# EAGLE design a130-8-octal-vca-expander (EAGLE 7.7.0)

## Sheet 1 of 5
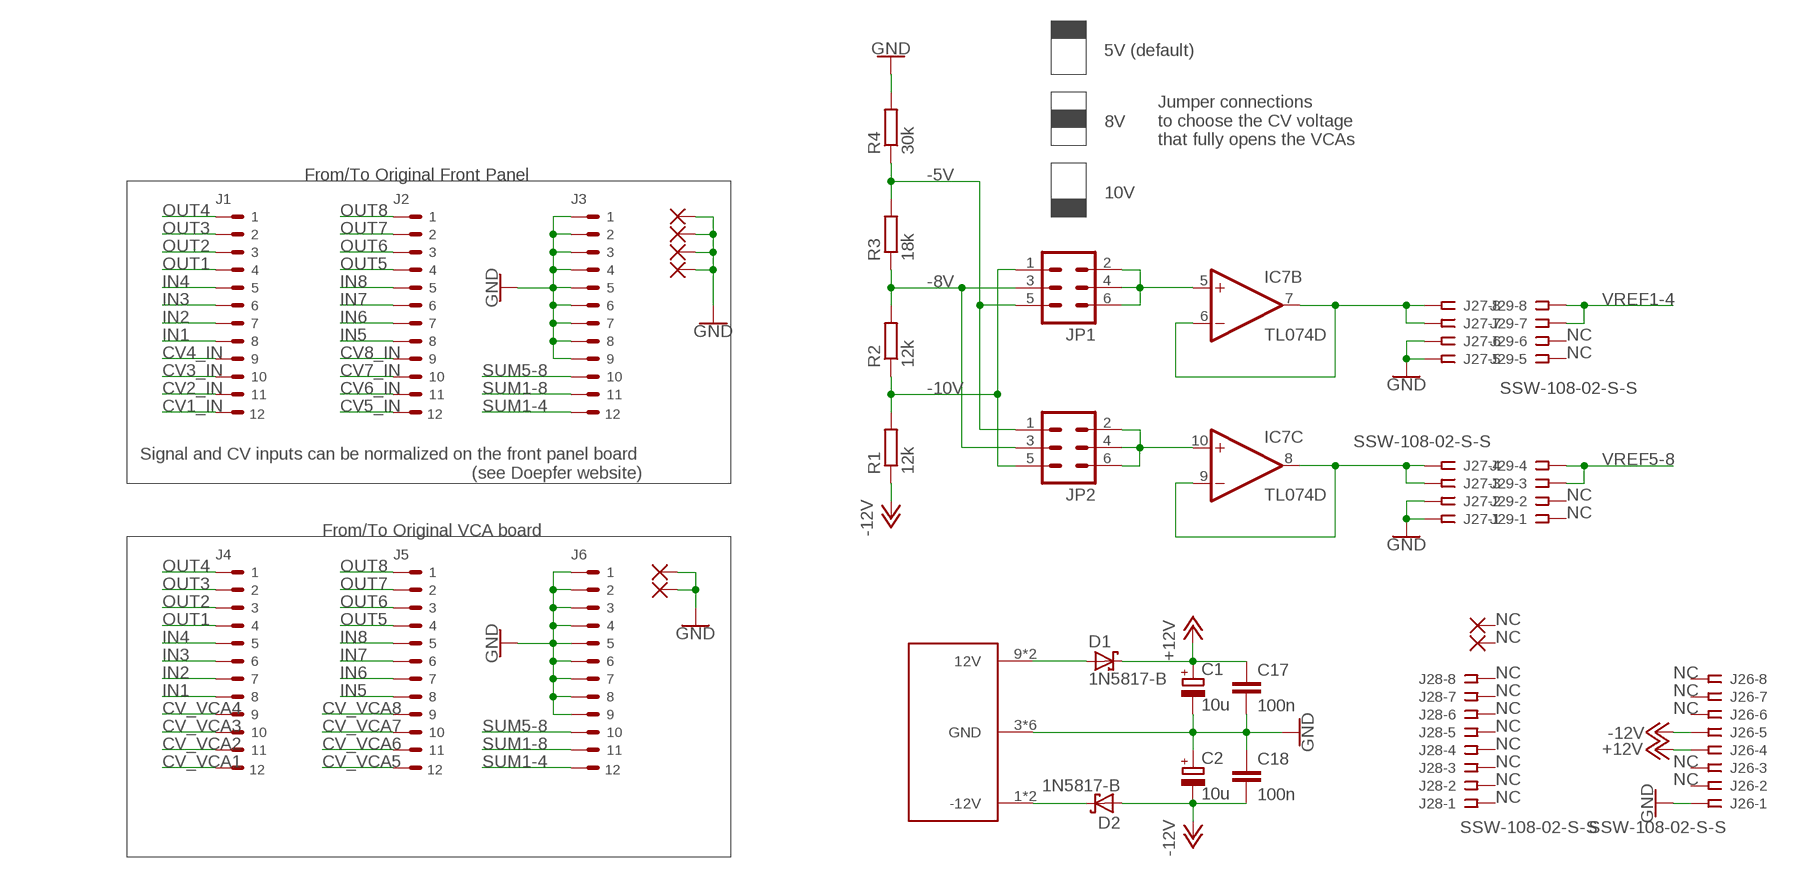
[diagram p0: schematic, sheet 1]

### Parts
C1  10u  CPOL-EUE2-5  [E2-5]
C2  10u  CPOL-EUE2-5  [E2-5]
C17  100n  C-EUC0603  [C0603]
C18  100n  C-EUC0603  [C0603]
D1  1N5817-B  [DO41-7.6]
D2  1N5817-B  [DO41-7.6]
IC7  TL074D  [SO14]
J1  PIN_HEADER_1X12_2MM_GRID  [PIN_HEADER_1X12_2MM_GRID]
J2  PIN_HEADER_1X12_2MM_GRID  [PIN_HEADER_1X12_2MM_GRID]
J3  PIN_HEADER_1X12_2MM_GRID  [PIN_HEADER_1X12_2MM_GRID]
J4  PIN_HEADER_1X12_2MM_GRID  [PIN_HEADER_1X12_2MM_GRID]
J5  PIN_HEADER_1X12_2MM_GRID  [PIN_HEADER_1X12_2MM_GRID]
J6  PIN_HEADER_1X12_2MM_GRID  [PIN_HEADER_1X12_2MM_GRID]
J25  A100-BUS_HEADER_10P  [DOEPFER_2X05]
J26  SSW-108-02-S-S  [SSW-108-02-S-S]
J27  SSW-108-02-S-S  [SSW-108-02-S-S]
J28  SSW-108-02-S-S  [SSW-108-02-S-S]
J29  SSW-108-02-S-S  [SSW-108-02-S-S]
JP1  MA03-2  [MA03-2]
JP2  MA03-2  [MA03-2]
PAD1  2,15/1,0  [2,15/1,0]
PAD2  2,15/1,0  [2,15/1,0]
PAD3  2,15/1,0  [2,15/1,0]
PAD4  2,15/1,0  [2,15/1,0]
PAD5  2,15/1,0  [2,15/1,0]
PAD6  2,15/1,0  [2,15/1,0]
PAD7  2,15/1,0  [2,15/1,0]
PAD9  2,15/1,0  [2,15/1,0]
R1  12k  R-EU_M0805  [M0805]
R2  12k  R-EU_M0805  [M0805]
R3  18k  R-EU_M0805  [M0805]
R4  30k  R-EU_M0805  [M0805]

### Nets
+12V: C1.+ C17.1 D1.C J26.4 ; also sheet 2,3,4,5
-5V: JP1.5 JP2.1 R3.2 R4.1
-8V: JP1.3 JP2.3 R2.2 R3.1
-10V: JP1.1 JP2.5 R1.2 R2.1
-12V: C2.- C18.2 D2.A J26.5 R1.1 ; also sheet 2,3,4,5
CV1_IN: J1.12(S11) ; also sheet 2
CV2_IN: J1.11(S10) ; also sheet 2
CV3_IN: J1.10(S9) ; also sheet 3
CV4_IN: J1.9(S8) ; also sheet 3
CV5_IN: J2.12(S11) ; also sheet 4
CV6_IN: J2.11(S10) ; also sheet 4
CV7_IN: J2.10(S9) ; also sheet 5
CV8_IN: J2.9(S8) ; also sheet 5
CV_VCA1: J4.12(S11) ; also sheet 2
CV_VCA2: J4.11(S10) ; also sheet 2
CV_VCA3: J4.10(S9) ; also sheet 3
CV_VCA4: J4.9(S8) ; also sheet 3
CV_VCA5: J5.12(S11) ; also sheet 4
CV_VCA6: J5.11(S10) ; also sheet 4
CV_VCA7: J5.10(S9) ; also sheet 5
CV_VCA8: J5.9(S8) ; also sheet 5
GND: C1.- C2.+ C17.2 C18.1 J3.1(S1) J3.2(S2) J3.3(S3) J3.4(S4) J3.5(S) J3.6(S5) J3.7(S6) J3.8(S7) J3.9(S8) J6.1(S1) J6.2(S2) J6.3(S3) J6.4(S4) J6.5(S) J6.6(S5) J6.7(S6) J6.8(S7) J6.9(S8) J25.3(GND) J25.4(GND) J25.5(GND) J25.6(GND) J25.7(GND) J25.8(GND) J26.1 J27.1 J27.2 J27.5 J27.6 PAD1.1(P) PAD2.1(P) PAD3.1(P) PAD4.1(P) PAD5.1(P) PAD6.1(P) R4.2 ; also sheet 2,3,4,5
IN1: J1.8(S7) J4.8(S7)
IN2: J1.7(S6) J4.7(S6)
IN3: J1.6(S5) J4.6(S5)
IN4: J1.4(S4) J4.4(S4)
IN5: J2.8(S7) J5.8(S7)
IN6: J2.7(S6) J5.7(S6)
IN7: J2.6(S5) J5.6(S5)
IN8: J2.4(S4) J5.4(S4)
N$4: D1.A J25.9(12V) J25.10(12V)
N$5: D2.C J25.1(-12V) J25.2(-12V)
N$27: IC7.5(B:+IN) JP1.2 JP1.4 JP1.6
N$57: IC7.6(B:-IN) IC7.7(B:OUT) J27.7 J27.8
N$73: IC7.10(C:+IN) JP2.2 JP2.4 JP2.6
N$87: IC7.8(C:OUT) IC7.9(C:-IN) J27.3 J27.4
OUT1: J1.3(S3) J4.3(S3)
OUT2: J1.2(S2) J4.2(S2)
OUT3: J1.1(S1) J4.1(S1)
OUT4: J1.5(S) J4.5(S)
OUT5: J2.3(S3) J5.3(S3)
OUT6: J2.2(S2) J5.2(S2)
OUT7: J2.1(S1) J5.1(S1)
OUT8: J2.5(S) J5.5(S)
SUM1-4: J3.12(S11) J6.12(S11)
SUM1-8: J3.11(S10) J6.11(S10)
SUM5-8: J3.10(S9) J6.10(S9)
VREF1-4: J29.7 J29.8 ; also sheet 2,3
VREF5-8: J29.3 J29.4 ; also sheet 4,5
Unconnected: J26.2 J26.3 J26.6 J26.7 J26.8 J28.1 J28.2 J28.3 J28.4 J28.5 J28.6 J28.7 J28.8 J29.1 J29.2 J29.5 J29.6 PAD7.1(P) PAD9.1(P)

### Notes on the sheet
- 5V (default)
- 8V
- Jumper connections
  to choose the CV voltage 
  that fully opens the VCAs
- From/To Original Front Panel
- 10V
- NC
- NC
- Signal and CV inputs can be normalized on the front panel board 
  (see Doepfer website)
- NC
- NC
- From/To Original VCA board
- NC
- NC
- NC | NC
- NC | NC
- NC | NC
- NC
- NC
- NC | NC
- NC | NC
- NC

## Sheet 2 of 5
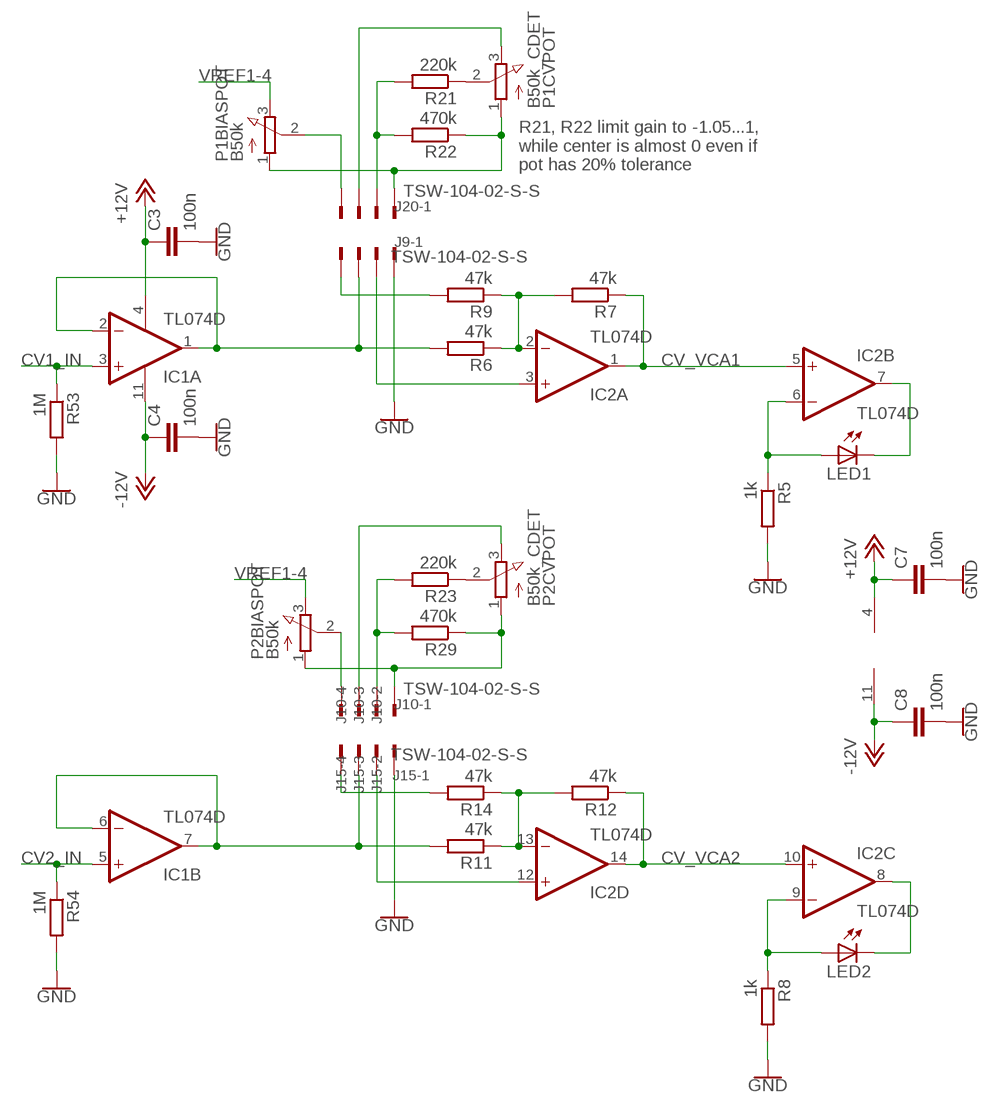
[diagram p1: schematic, sheet 2]

### Parts
C3  100n  C-EUC0603  [C0603]
C4  100n  C-EUC0603  [C0603]
C7  100n  C-EUC0603  [C0603]
C8  100n  C-EUC0603  [C0603]
IC1  TL074D  [SO14]
IC2  TL074D  [SO14]
IC3  TL074D  [SO14]
J9  TSW-104-02-S-S  [TSW-104-02-S-S]
J10  TSW-104-02-S-S  [TSW-104-02-S-S]
J15  TSW-104-02-S-S  [TSW-104-02-S-S]
J20  TSW-104-02-S-S  [TSW-104-02-S-S]
LED1  LED3MM  [LED3MM]
LED2  LED3MM  [LED3MM]
P1BIAS  B50k  P0915N_NARROW  [EVUF]
P1CV  B50k_CDET  P0915N_NARROW  [EVUF]
P2BIAS  B50k  P0915N_NARROW  [EVUF]
P2CV  B50k_CDET  P0915N_NARROW  [EVUF]
R5  1k  R-EU_M0805  [M0805]
R6  47k  R-EU_M0805  [M0805]
R7  47k  R-EU_M0805  [M0805]
R8  1k  R-EU_M0805  [M0805]
R9  47k  R-EU_M0805  [M0805]
R11  47k  R-EU_M0805  [M0805]
R12  47k  R-EU_M0805  [M0805]
R14  47k  R-EU_M0805  [M0805]
R21  220k  R-EU_M0805  [M0805]
R22  470k  R-EU_M0805  [M0805]
R23  220k  R-EU_M0805  [M0805]
R29  470k  R-EU_M0805  [M0805]
R53  1M  R-EU_M0805  [M0805]
R54  1M  R-EU_M0805  [M0805]

### Nets
+12V: C3.1 C7.1 IC1.4(P:V+) IC3.4(P:V+) ; also sheet 1,3,4,5
-12V: C4.1 C8.1 IC1.11(P:V-) IC3.11(P:V-) ; also sheet 1,3,4,5
CV1_IN: IC1.3(A:+IN) R53.1 ; also sheet 1
CV2_IN: IC1.5(B:+IN) R54.1 ; also sheet 1
CV_VCA1: IC2.1(A:OUT) IC2.5(B:+IN) R7.1 ; also sheet 1
CV_VCA2: IC2.10(C:+IN) IC2.14(D:OUT) R12.1 ; also sheet 1
GND: C3.2 C4.2 C7.2 C8.2 J15.1 J20.1 R5.2 R8.2 R53.2 R54.2 ; also sheet 1,3,4,5
N$1: J9.4 P1BIAS.2
N$2: IC1.1(A:OUT) IC1.2(A:-IN) J20.3 R6.2
N$3: IC2.2(A:-IN) R6.1 R7.2 R9.1
N$8: J20.4 R9.2
N$9: IC1.6(B:-IN) IC1.7(B:OUT) J15.3 R11.2
N$10: IC2.12(D:+IN) J15.2
N$11: IC2.13(D:-IN) R11.1 R12.2 R14.1
N$12: J9.1 P1BIAS.1 P1CV.1 R22.1
N$19: IC2.6(B:-IN) LED1.A R5.1
N$20: IC2.7(B:OUT) LED1.K(C)
N$21: IC2.8(C:OUT) LED2.K(C)
N$22: IC2.9(C:-IN) LED2.A R8.1
N$53: J15.4 R14.2
N$54: P2CV.2 R23.1
N$58: J9.3 P1CV.3
N$59: IC2.3(A:+IN) J20.2
N$60: J10.1 P2BIAS.1 P2CV.1 R29.1
N$61: J10.2 R23.2 R29.2
N$62: J10.3 P2CV.3
N$63: J10.4 P2BIAS.2
N$86: P1CV.2 R21.1
N$88: J9.2 R21.2 R22.2
VREF1-4: P1BIAS.3 P2BIAS.3 ; also sheet 1,3
Unconnected: P1BIAS.M1(C$1) P1BIAS.M2(C$2) P1CV.M1(C$1) P1CV.M2(C$2) P2BIAS.M1(C$1) P2BIAS.M2(C$2) P2CV.M1(C$1) P2CV.M2(C$2)

### Notes on the sheet
- R21, R22 limit gain to -1.05...1,
  while center is almost 0 even if
  pot has 20% tolerance

## Sheet 3 of 5
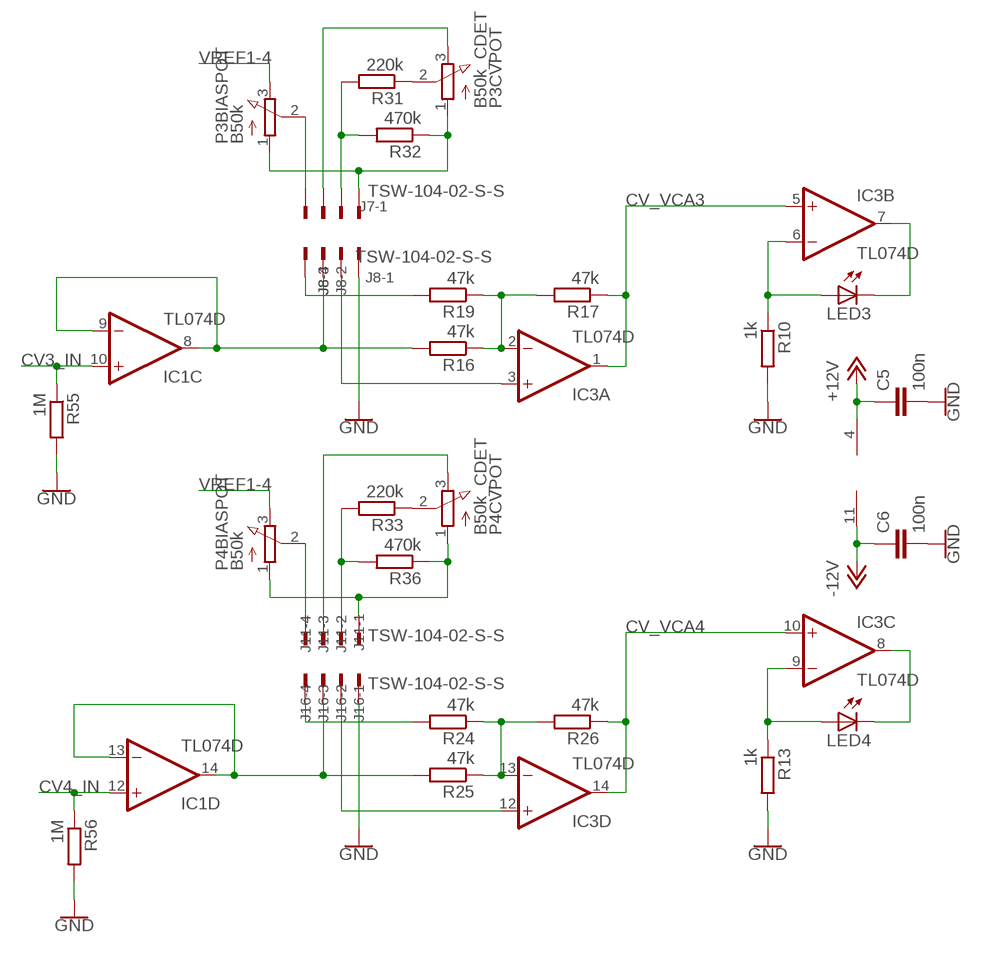
[diagram p2: schematic, sheet 3]

### Parts
C5  100n  C-EUC0603  [C0603]
C6  100n  C-EUC0603  [C0603]
J7  TSW-104-02-S-S  [TSW-104-02-S-S]
J8  TSW-104-02-S-S  [TSW-104-02-S-S]
J11  TSW-104-02-S-S  [TSW-104-02-S-S]
J16  TSW-104-02-S-S  [TSW-104-02-S-S]
LED3  LED3MM  [LED3MM]
LED4  LED3MM  [LED3MM]
P3BIAS  B50k  P0915N_NARROW  [EVUF]
P3CV  B50k_CDET  P0915N_NARROW  [EVUF]
P4BIAS  B50k  P0915N_NARROW  [EVUF]
P4CV  B50k_CDET  P0915N_NARROW  [EVUF]
R10  1k  R-EU_M0805  [M0805]
R13  1k  R-EU_M0805  [M0805]
R16  47k  R-EU_M0805  [M0805]
R17  47k  R-EU_M0805  [M0805]
R19  47k  R-EU_M0805  [M0805]
R24  47k  R-EU_M0805  [M0805]
R25  47k  R-EU_M0805  [M0805]
R26  47k  R-EU_M0805  [M0805]
R31  220k  R-EU_M0805  [M0805]
R32  470k  R-EU_M0805  [M0805]
R33  220k  R-EU_M0805  [M0805]
R36  470k  R-EU_M0805  [M0805]
R55  1M  R-EU_M0805  [M0805]
R56  1M  R-EU_M0805  [M0805]

### Nets
+12V: C5.1 IC2.4(P:V+) ; also sheet 1,2,4,5
-12V: C6.1 IC2.11(P:V-) ; also sheet 1,2,4,5
CV3_IN: IC1.10(C:+IN) R55.1 ; also sheet 1
CV4_IN: IC1.12(D:+IN) R56.1 ; also sheet 1
CV_VCA3: IC3.1(A:OUT) IC3.5(B:+IN) R17.1 ; also sheet 1
CV_VCA4: IC3.10(C:+IN) IC3.14(D:OUT) R26.1 ; also sheet 1
GND: C5.2 C6.2 J8.1 J16.1 R10.2 R13.2 R55.2 R56.2 ; also sheet 1,2,4,5
N$6: IC1.8(C:OUT) IC1.9(C:-IN) J8.3 R16.2
N$7: J7.4 P3BIAS.2
N$13: IC3.2(A:-IN) R16.1 R17.2 R19.1
N$14: J8.4 R19.2
N$15: IC1.13(D:-IN) IC1.14(D:OUT) J16.3 R25.2
N$16: J16.4 R24.2
N$17: IC3.13(D:-IN) R24.1 R25.1 R26.2
N$18: IC3.12(D:+IN) J16.2
N$23: IC3.6(B:-IN) LED3.A R10.1
N$24: IC3.7(B:OUT) LED3.K(C)
N$25: IC3.9(C:-IN) LED4.A R13.1
N$26: IC3.8(C:OUT) LED4.K(C)
N$64: J7.1 P3BIAS.1 P3CV.1 R32.1
N$65: J7.2 R31.2 R32.2
N$66: J7.3 P3CV.3
N$67: IC3.3(A:+IN) J8.2
N$68: J11.1 P4BIAS.1 P4CV.1 R36.1
N$69: J11.4 P4BIAS.2
N$70: J11.3 P4CV.3
N$71: J11.2 R33.2 R36.2
N$89: P3CV.2 R31.1
N$90: P4CV.2 R33.1
VREF1-4: P3BIAS.3 P4BIAS.3 ; also sheet 1,2
Unconnected: P3BIAS.M1(C$1) P3BIAS.M2(C$2) P3CV.M1(C$1) P3CV.M2(C$2) P4BIAS.M1(C$1) P4BIAS.M2(C$2) P4CV.M1(C$1) P4CV.M2(C$2)

## Sheet 4 of 5
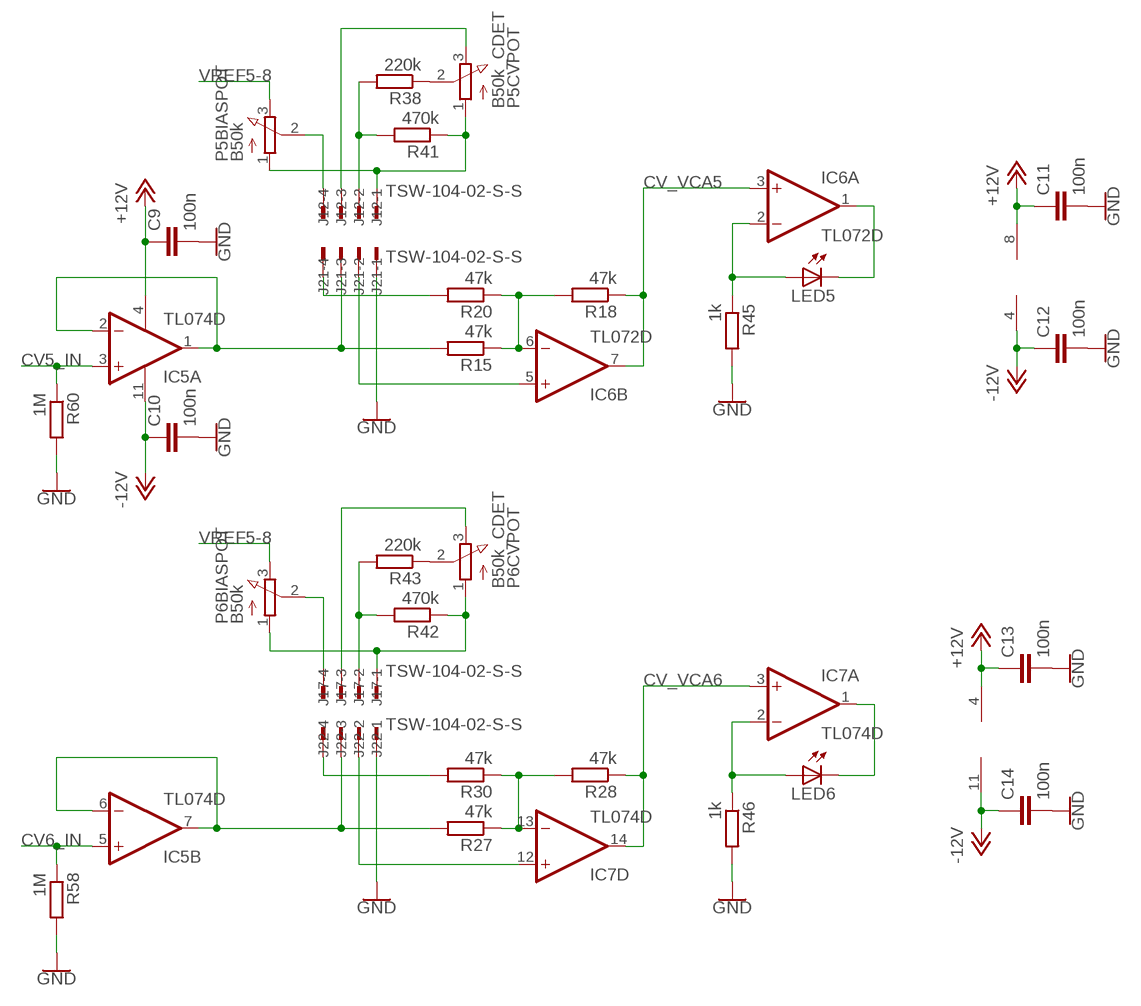
[diagram p3: schematic, sheet 4]

### Parts
C9  100n  C-EUC0603  [C0603]
C10  100n  C-EUC0603  [C0603]
C11  100n  C-EUC0603  [C0603]
C12  100n  C-EUC0603  [C0603]
C13  100n  C-EUC0603  [C0603]
C14  100n  C-EUC0603  [C0603]
IC5  TL074D  [SO14]
IC6  TL072D  [SO08]
J12  TSW-104-02-S-S  [TSW-104-02-S-S]
J17  TSW-104-02-S-S  [TSW-104-02-S-S]
J21  TSW-104-02-S-S  [TSW-104-02-S-S]
J22  TSW-104-02-S-S  [TSW-104-02-S-S]
LED5  LED3MM  [LED3MM]
LED6  LED3MM  [LED3MM]
P5BIAS  B50k  P0915N_NARROW  [EVUF]
P5CV  B50k_CDET  P0915N_NARROW  [EVUF]
P6BIAS  B50k  P0915N_NARROW  [EVUF]
P6CV  B50k_CDET  P0915N_NARROW  [EVUF]
R15  47k  R-EU_M0805  [M0805]
R18  47k  R-EU_M0805  [M0805]
R20  47k  R-EU_M0805  [M0805]
R27  47k  R-EU_M0805  [M0805]
R28  47k  R-EU_M0805  [M0805]
R30  47k  R-EU_M0805  [M0805]
R38  220k  R-EU_M0805  [M0805]
R41  470k  R-EU_M0805  [M0805]
R42  470k  R-EU_M0805  [M0805]
R43  220k  R-EU_M0805  [M0805]
R45  1k  R-EU_M0805  [M0805]
R46  1k  R-EU_M0805  [M0805]
R58  1M  R-EU_M0805  [M0805]
R60  1M  R-EU_M0805  [M0805]

### Nets
+12V: C9.1 C11.1 C13.1 IC5.4(P:V+) IC6.8(P:V+) IC7.4(P:V+) ; also sheet 1,2,3,5
-12V: C10.1 C12.1 C14.1 IC5.11(P:V-) IC6.4(P:V-) IC7.11(P:V-) ; also sheet 1,2,3,5
CV5_IN: IC5.3(A:+IN) R60.1 ; also sheet 1
CV6_IN: IC5.5(B:+IN) R58.1 ; also sheet 1
CV_VCA5: IC6.3(A:+IN) IC6.7(B:OUT) R18.1 ; also sheet 1
CV_VCA6: IC7.3(A:+IN) IC7.14(D:OUT) R28.1 ; also sheet 1
GND: C9.2 C10.2 C11.2 C12.2 C13.2 C14.2 J21.1 J22.1 R45.2 R46.2 R58.2 R60.2 ; also sheet 1,2,3,5
N$28: J17.4 P6BIAS.2
N$29: IC5.1(A:OUT) IC5.2(A:-IN) J21.3 R15.2
N$30: J12.2 R38.2 R41.2
N$31: IC6.6(B:-IN) R15.1 R18.2 R20.1
N$32: J12.1 P5BIAS.1 P5CV.1 R41.1
N$33: IC5.6(B:-IN) IC5.7(B:OUT) J22.3 R27.2
N$34: J17.1 P6BIAS.1 P6CV.1 R42.1
N$35: IC7.13(D:-IN) R27.1 R28.2 R30.1
N$36: J22.4 R30.2
N$45: IC6.2(A:-IN) LED5.A R45.1
N$46: IC6.1(A:OUT) LED5.K(C)
N$47: IC7.1(A:OUT) LED6.K(C)
N$48: IC7.2(A:-IN) LED6.A R46.1
N$55: J17.2 R42.2 R43.2
N$72: J12.3 P5CV.3
N$74: J12.4 P5BIAS.2
N$75: IC6.5(B:+IN) J21.2
N$76: J21.4 R20.2
N$77: J17.3 P6CV.3
N$78: IC7.12(D:+IN) J22.2
N$91: P5CV.2 R38.1
N$92: P6CV.2 R43.1
VREF5-8: P5BIAS.3 P6BIAS.3 ; also sheet 1,5
Unconnected: P5BIAS.M1(C$1) P5BIAS.M2(C$2) P5CV.M1(C$1) P5CV.M2(C$2) P6BIAS.M1(C$1) P6BIAS.M2(C$2) P6CV.M1(C$1) P6CV.M2(C$2)

## Sheet 5 of 5
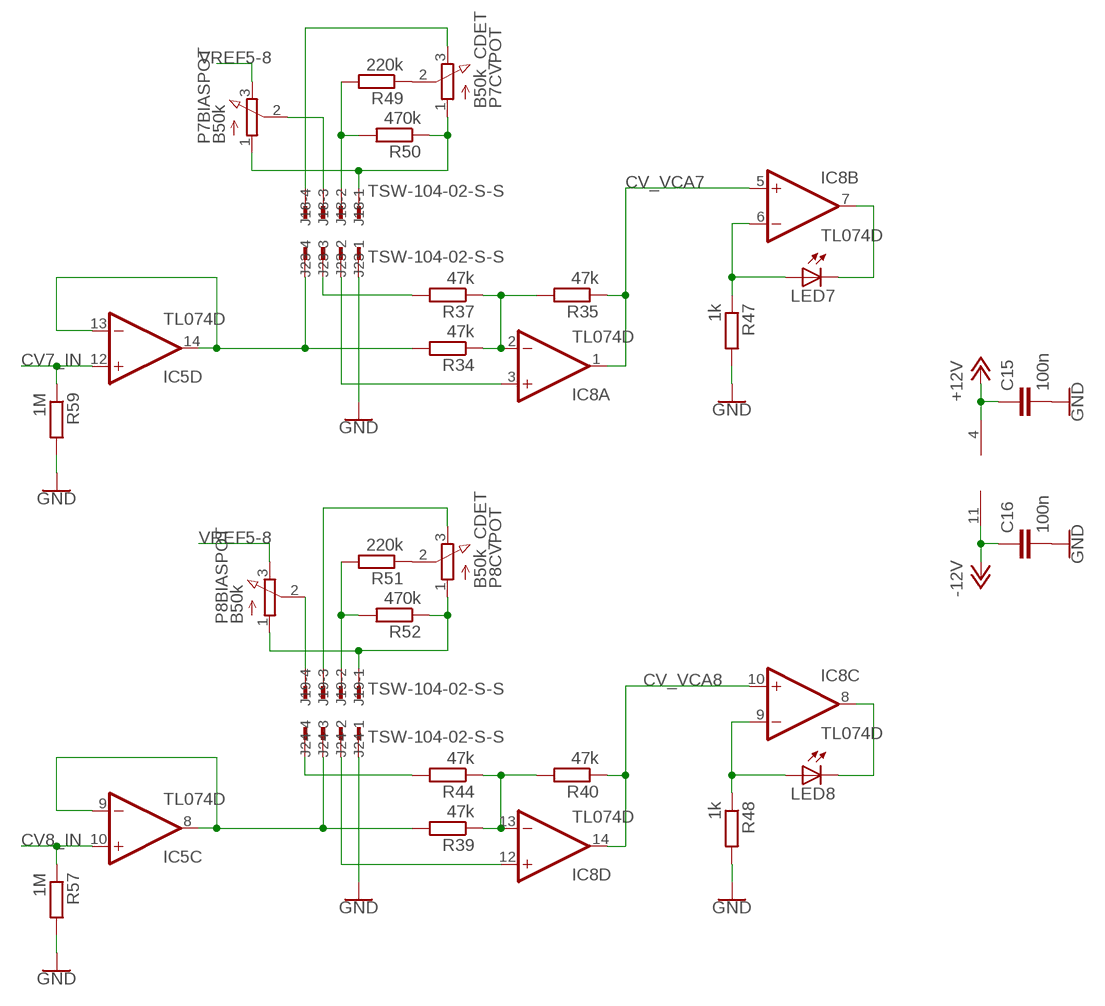
[diagram p4: schematic, sheet 5]

### Parts
C15  100n  C-EUC0603  [C0603]
C16  100n  C-EUC0603  [C0603]
IC8  TL074D  [SO14]
J18  TSW-104-02-S-S  [TSW-104-02-S-S]
J19  TSW-104-02-S-S  [TSW-104-02-S-S]
J23  TSW-104-02-S-S  [TSW-104-02-S-S]
J24  TSW-104-02-S-S  [TSW-104-02-S-S]
LED7  LED3MM  [LED3MM]
LED8  LED3MM  [LED3MM]
P7BIAS  B50k  P0915N_NARROW  [EVUF]
P7CV  B50k_CDET  P0915N_NARROW  [EVUF]
P8BIAS  B50k  P0915N_NARROW  [EVUF]
P8CV  B50k_CDET  P0915N_NARROW  [EVUF]
R34  47k  R-EU_M0805  [M0805]
R35  47k  R-EU_M0805  [M0805]
R37  47k  R-EU_M0805  [M0805]
R39  47k  R-EU_M0805  [M0805]
R40  47k  R-EU_M0805  [M0805]
R44  47k  R-EU_M0805  [M0805]
R47  1k  R-EU_M0805  [M0805]
R48  1k  R-EU_M0805  [M0805]
R49  220k  R-EU_M0805  [M0805]
R50  470k  R-EU_M0805  [M0805]
R51  220k  R-EU_M0805  [M0805]
R52  470k  R-EU_M0805  [M0805]
R57  1M  R-EU_M0805  [M0805]
R59  1M  R-EU_M0805  [M0805]

### Nets
+12V: C15.1 IC8.4(P:V+) ; also sheet 1,2,3,4
-12V: C16.1 IC8.11(P:V-) ; also sheet 1,2,3,4
CV7_IN: IC5.12(D:+IN) R59.1 ; also sheet 1
CV8_IN: IC5.10(C:+IN) R57.1 ; also sheet 1
CV_VCA7: IC8.1(A:OUT) IC8.5(B:+IN) R35.1 ; also sheet 1
CV_VCA8: IC8.10(C:+IN) IC8.14(D:OUT) R40.1 ; also sheet 1
GND: C15.2 C16.2 J23.1 J24.1 R47.2 R48.2 R57.2 R59.2 ; also sheet 1,2,3,4
N$37: J23.3 R37.2
N$38: J18.4 P7CV.3
N$39: IC8.2(A:-IN) R34.1 R35.2 R37.1
N$40: J18.2 R49.2 R50.2
N$41: IC5.8(C:OUT) IC5.9(C:-IN) J24.3 R39.2
N$42: J19.1 P8BIAS.1 P8CV.1 R52.1
N$43: IC8.13(D:-IN) R39.1 R40.2 R44.1
N$44: IC8.12(D:+IN) J24.2
N$49: IC8.6(B:-IN) LED7.A R47.1
N$50: IC8.7(B:OUT) LED7.K(C)
N$51: IC8.9(C:-IN) LED8.A R48.1
N$52: IC8.8(C:OUT) LED8.K(C)
N$56: P7CV.2 R49.1
N$79: J18.1 P7BIAS.1 P7CV.1 R50.1
N$80: IC5.13(D:-IN) IC5.14(D:OUT) J23.4 R34.2
N$81: J18.3 P7BIAS.2
N$82: J19.3 P8CV.3
N$83: IC8.3(A:+IN) J23.2
N$84: J19.4 P8BIAS.2
N$85: J24.4 R44.2
N$94: P8CV.2 R51.1
N$96: J19.2 R51.2 R52.2
VREF5-8: P7BIAS.3 P8BIAS.3 ; also sheet 1,4
Unconnected: P7BIAS.M1(C$1) P7BIAS.M2(C$2) P7CV.M1(C$1) P7CV.M2(C$2) P8BIAS.M1(C$1) P8BIAS.M2(C$2) P8CV.M1(C$1) P8CV.M2(C$2)

## Library data of the parts
C1 C2 = rcl:CPOL-EU: POLARIZED CAPACITOR, European symbol
C3-C18 = rcl:C-EU: CAPACITOR, European symbol
D1 D2 = diode:1N581*: 1.0A SCHOTTKY BARRIER RECTIFIER Source: http://www.diodes.com/datasheets/ds23001.pdf
IC1-IC3 IC5 IC7 IC8 = linear:TL074: OP AMP
IC6 = linear:TL072: OP AMP
J1-J6 = user_doepfer:PIN_HEADER_1X12_2MM_GRID: 12 Pin - 2mm Single Row
J7-J12 J15-J24 = con-samtec:TSW-104-02-S-S: THROUGH-HOLE .025" SQ POST HEADER Source: Samtec TSW.pdf; OC_FARNELL: unknown; OC_NEWARK: unknown
J25 = user_doepfer:A100-BUS_HEADER_10P: Doepfer A-100 system bus pin header connector 10 pin version
J26-J29 = con-samtec:SSW-108-02-S-S: THROUGH-HOLE .025" SQ POST SOCKET Source: Samtec SSW.pdf; MPN: SSW-108-02-S-S; OC_FARNELL: unknown; OC_NEWARK: 11P9448
JP1 JP2 = con-lstb:MA03-2: PIN HEADER; OC_FARNELL: unknown; OC_NEWARK: unknown
LED1-LED8 = led:LED: LED OSRAM: - CHIPLED LG R971, LG N971, LY N971, LG Q971, LY Q971, LO R971, LY R971 LH N974, LH R974 LS Q976, LO Q976, LY Q976 LO Q996 - Hyper CHIPLED LW Q18S LB Q993, LB Q99A, LB R99A - SideLED LS A670, LO A670, LY A670, LG A670, LP A670 LB A673, LV A673, LT A673, LW A673 LH A674 LY A675 LS A676, LA A676, LO A676, LY A676, LW A676 LS A679, LY A679, LG A679 - Hyper Micro SIDELED® LS Y876, LA Y876, LO Y876, LY Y876 LT Y87S - SmartLED LW L88C, LW L88S LB L89C, LB L89S, LG L890 LS L89K, LO L89K, LY L89K LS L896, LA L896, LO L896, LY L896 - TOPLED LS T670, LO T670, LY T670, LG T670, LP T670 LSG T670, LSP T670, LSY T670, LOP T670, LYG T670 LG T671, LOG T671, LSG T671 LB T673, LV T673, LT T673, LW T673 LH T674 LS T676, LA T676, LO T676, LY T676, LB T676, LH T676, LSB T676, LW T676 LB T67C, LV T67C, LT T67C, LS T67K, LO T67K, LY T67K, LW E67C LS E67B, LA E67B, LO E67B, LY E67B, LB E67C, LV E67C, LT E67C LW T67C LS T679, LY T679, LG T679 LS T770, LO T770, LY T770, LG T770, LP T770 LB T773, LV T773, LT T773, LW T773 LH T774 LS E675, LA E675, LY E675, LS T675 LS T776, LA T776, LO T776, LY T776, LB T776 LHGB T686 LT T68C, LB T68C - Hyper Mini TOPLED® LB M676 - Mini TOPLED Santana® LG M470 LS M47K, LO M47K, LY M47K Source: http://www.osram.convergy.de LUXEON: - LUMILED® LXK2-PW12-R00, LXK2-PW12-S00, LXK2-PW14-U00, LXK2-PW14-V00 LXK2-PM12-R00, LXK2-PM12-S00, LXK2-PM14-U00 LXK2-PE12-Q00, LXK2-PE12-R00, LXK2-PE12-S00, LXK2-PE14-T00, LXK2-PE14-U00 LXK2-PB12-K00, LXK2-PB12-L00, LXK2-PB12-M00, LXK2-PB14-N00, LXK2-PB14-P00, LXK2-PB14-Q00 LXK2-PR12-L00, LXK2-PR12-M00, LXK2-PR14-Q00, LXK2-PR14-R00 LXK2-PD12-Q00, LXK2-PD12-R00, LXK2-PD12-S00 LXK2-PH12-R00, LXK2-PH12-S00 LXK2-PL12-P00, LXK2-PL12-Q00, LXK2-PL12-R00 Source: www.luxeon.com KINGBRIGHT: KA-3528ASYC Source: www.kingbright.com
P1BIAS P1CV P2BIAS P2CV P3BIAS P3CV P4BIAS P4CV P5BIAS P5CV P6BIAS P6CV P7BIAS P7CV P8BIAS P8CV = user_potentiometer:P0915N_NARROW: 9 mm potentiometer TT electronics vertical PCB mount, 6 mm shaft
PAD1-PAD7 PAD9 = wirepad:2,15/1,0: THROUGH-HOLE PAD
R1-R60 = rcl:R-EU_: RESISTOR, European symbol

## Board
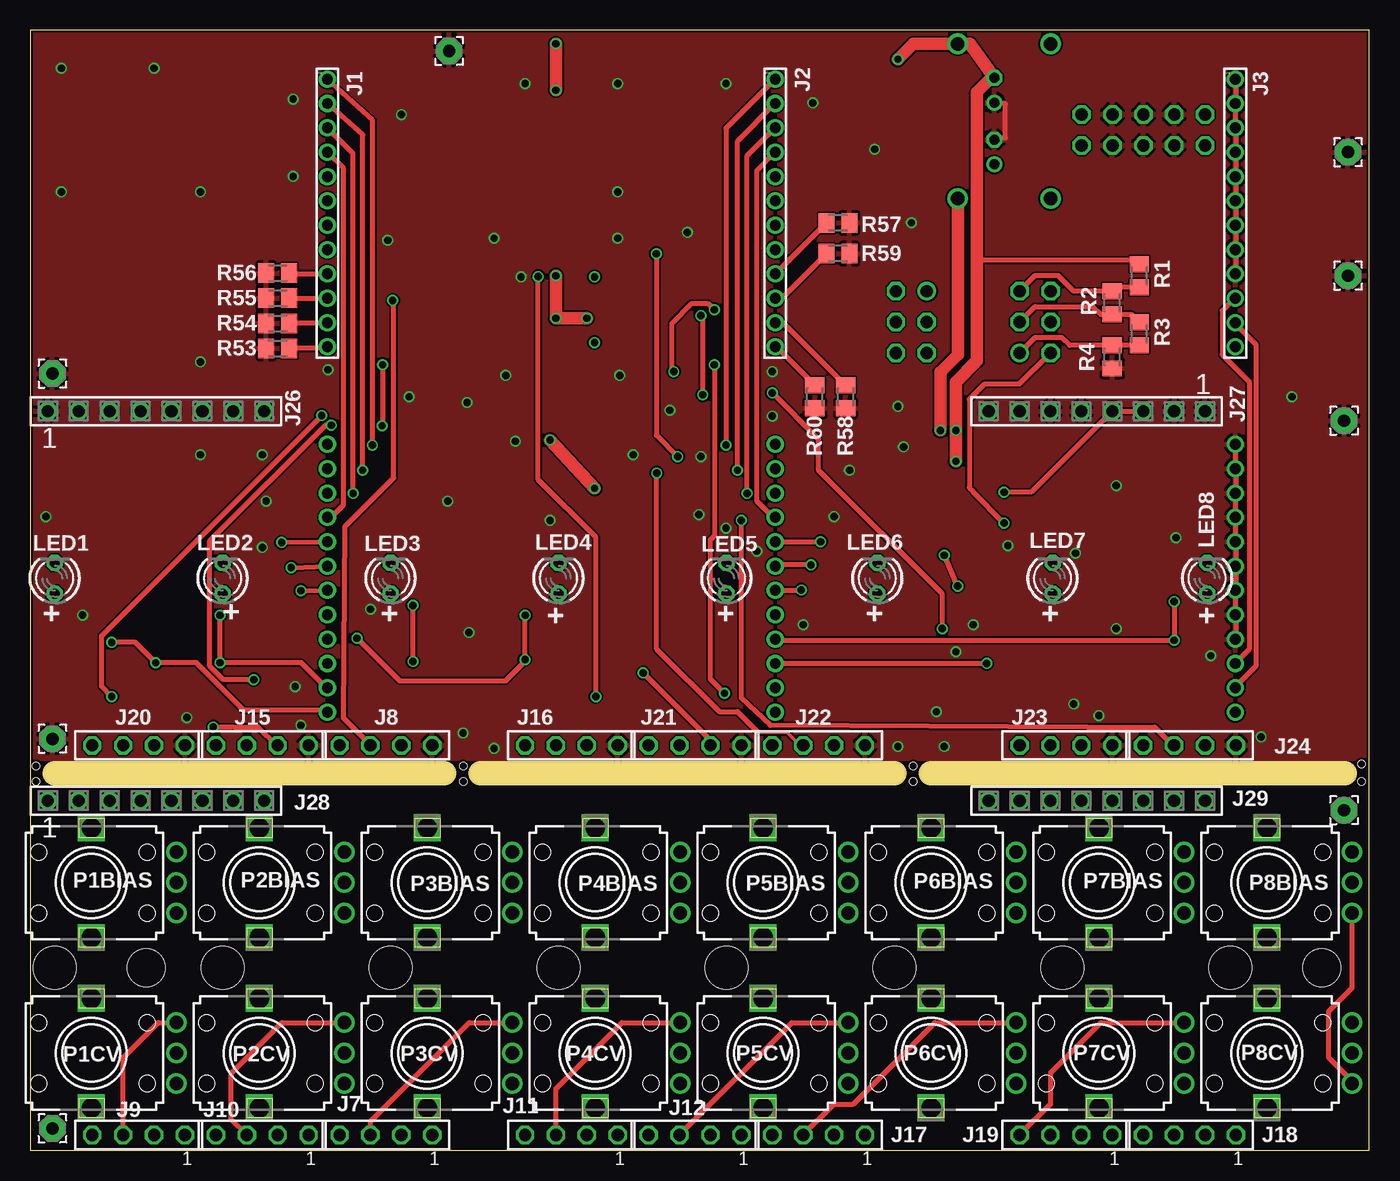
[diagram p5: board, top side]
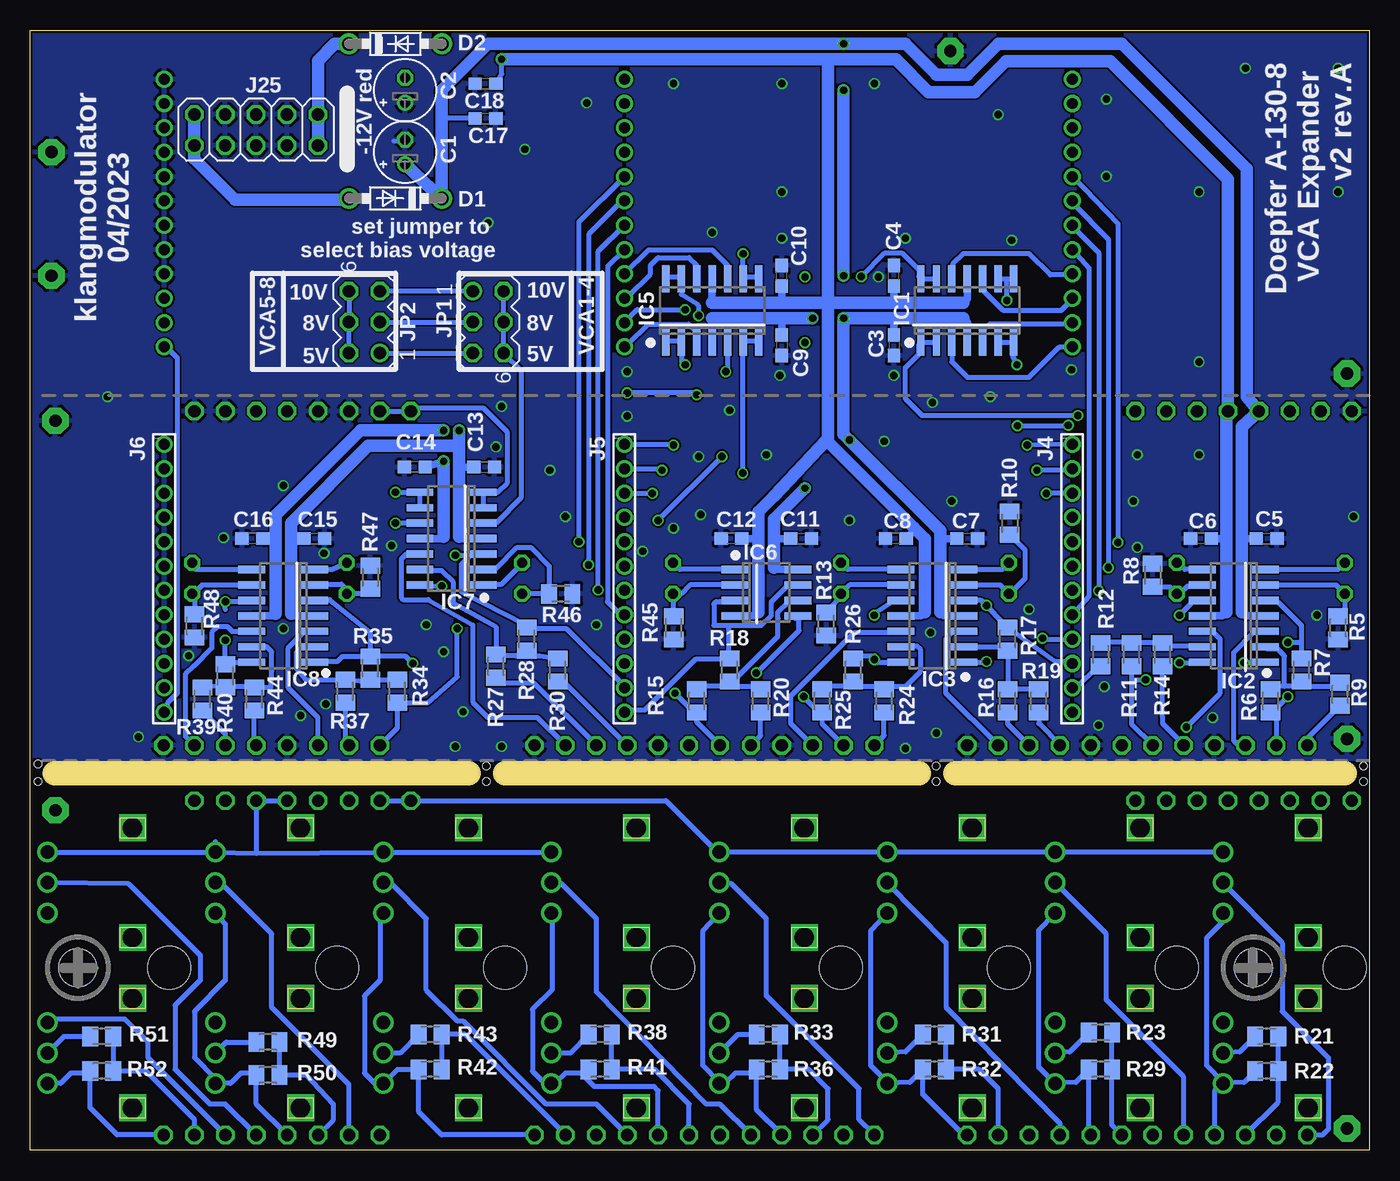
[diagram p6: board, bottom side, seen from below]

Size 110 x 92 mm. Coordinates in mm from the lower left corner, seen from the top.
Outline: 0,0 110,0 110,92 0,92 0,0
Copper layers (1*16): Top 0.035mm / dielectric 1.5mm / Bottom 0.035mm
Design rules "aisler_2_layer *": minimum track width 16mil, minimum drill 0.6mm, track to track 0.15mm, track to pad 0.15mm, pad to pad 0.1mm, via to via 0.1mm, smd to smd 0.1mm, copper to edge 0.2mm, drill to drill 0.21mm, minimum pad ring 0.25mm, minimum via ring 0.15mm, stop-mask expansion 0mil, vias tented up to drill 0mil, thermal gap 10mil
Holes 0.6 mm at 0.48,31.59 0.48,30.32 35.56,31.59 35.56,30.32 72.55,31.59 72.55,30.32 109.38,31.75 109.38,30.32
Holes 3.5 mm at 98.6,15 84.8,15 2,15 71,15 57.2,15 43.4,15 29.6,15 15.8,15
Holes 3.1 mm at 106.1,15 9.5,15
tRestrict: 1 lines
bRestrict: 1 lines
Milling: 3 lines

### Footprints (pad centres in the part's own frame; a part is rotated, then mirrored left to right if it is on the bottom)
E2-5 = drill 0.813 pad 1.27: + -1.016,0 | drill 0.813 pad 1.27 octagon: - 1.016,0
C0603 = smd 1.1 x 1: 1 -0.85,0; 2 0.85,0
DO41-7.6 = drill 1.1 pad 1.7: A 3.81,0; C -3.81,0
SO14 = smd 0.6 x 2.2: 1 -3.81,-2.6; 2 -2.54,-2.6; 3 -1.27,-2.6; 4 0,-2.6; 5 1.27,-2.6; 6 2.54,-2.6; 7 3.81,-2.6; 8 3.81,2.6; 9 2.54,2.6; 10 1.27,2.6; 11 0,2.6; 12 -1.27,2.6; 13 -2.54,2.6; 14 -3.81,2.6
SO08 = smd 0.6 x 2.2: 1 -1.905,-2.6; 2 -0.635,-2.6; 3 0.635,-2.6; 4 1.905,-2.6; 5 1.905,2.6; 6 0.635,2.6; 7 -0.635,2.6; 8 -1.905,2.6
PIN_HEADER_1X12_2MM_GRID = drill 0.9 pad 1.27: 1 0,0; 2 2,0; 3 4,0; 4 6,0; 5 8,0; 6 10,0; 7 12,0; 8 14,0; 9 16,0; 10 18,0; 11 20,0; 12 22,0
TSW-104-02-S-S = drill 1 pad 1.5 octagon: 1 3.81,0; 2 1.27,0; 3 -1.27,0; 4 -3.81,0
DOEPFER_2X05 = drill 1.016 octagon: 1 -5.08,-1.27; 2 -5.08,1.27; 3 -2.54,-1.27; 4 -2.54,1.27; 5 0,-1.27; 6 0,1.27; 7 2.54,-1.27; 8 2.54,1.27; 9 5.08,-1.27; 10 5.08,1.27
SSW-108-02-S-S = drill 1 pad 1.5 octagon: 1 -8.89,0; 2 -6.35,0; 3 -3.81,0; 4 -1.27,0; 5 1.27,0; 6 3.81,0; 7 6.35,0; 8 8.89,0
MA03-2 = drill 1.016: 1 -2.54,-1.27 | drill 1.016 octagon: 2 -2.54,1.27; 3 0,-1.27; 4 0,1.27; 5 2.54,-1.27; 6 2.54,1.27
LED3MM = drill 0.813 octagon: A -1.27,0; K 1.27,0
EVUF = drill 1.1 pad 1.676: 1 -2.5,-7; 2 0,-7; 3 2.5,-7 | drill 1.6 pad 2.2 square: M1 4.5,0; M2 -4.5,0
2,15/1,0 = drill 1.016 pad 2.159 octagon: 1 0,0
M0805 = smd 1.3 x 1.6: 1 -0.95,0; 2 0.95,0

### Placement (x,y rotation side)
C1  79.22,82.01 90 bottom
C2  79.22,87.09 90 bottom
C3  39.05,66.14 270 bottom
C4  39.05,71.85 90 bottom
C5  8.41,50.26 0 bottom
C6  13.81,50.26 180 bottom
C7  33.02,50.26 0 bottom
C8  38.89,50.26 180 bottom
C9  48.26,66.14 270 bottom
C10  48.26,71.85 90 bottom
C11  46.67,50.26 0 bottom
C12  52.39,50.26 180 bottom
C13  72.71,56.13 0 bottom
C14  78.42,56.13 180 bottom
C15  86.68,50.26 0 bottom
C16  91.76,50.26 180 bottom
C17  72.61,84.77 0 bottom
C18  72.61,87.63 0 bottom
D1  80.01,78.2 180 bottom
D2  80.01,90.9 0 bottom
IC1  33.02,68.99 0 bottom
IC2  11.11,43.91 90 bottom
IC3  35.88,43.91 90 bottom
IC5  53.98,68.99 0 bottom
IC6  49.53,45.81 270 bottom
IC7  75.41,50.26 90 bottom
IC8  89.22,43.91 90 bottom
J1  24.4,88 270 top
J2  61.2,88 270 top
J3  99,88 270 top
J4  24.4,58 270 bottom
J5  61.2,58 270 bottom
J6  99,58 270 bottom
J7  29.21,1.27 0 top
J8  29.21,33.27 0 top
J9  8.89,1.27 0 top
J10  19.05,1.27 0 top
J11  44.45,1.27 0 top
J12  54.61,1.27 0 top
J15  19.05,33.27 0 top
J16  44.45,33.27 0 top
J17  64.77,1.27 0 top
J18  85.09,1.27 0 top
J19  95.25,1.27 0 top
J20  8.89,33.27 0 top
J21  54.61,33.27 0 top
J22  64.77,33.27 0 top
J23  85.09,33.27 0 top
J24  95.25,33.27 0 top
J25  91.45,83.83 180 bottom
J26  10.32,60.73 0 top
J27  87.63,60.73 180 top
J28  10.32,28.73 0 top
J29  87.63,28.73 180 top
JP1  72.39,68.04 270 bottom
JP2  82.55,68.04 90 bottom
LED1  2,47 90 top
LED2  15.8,47 90 top
LED3  29.6,47 90 top
LED4  43.4,47 90 top
LED5  57.2,47 90 top
LED6  69.6,47 90 top
LED7  84,47 90 top
LED8  96.7,47 90 top
P1BIAS  5,22 90 top
P1CV  5,8 90 top
P2BIAS  18.8,22 90 top
P2CV  18.8,8 90 top
P3BIAS  32.6,22 90 top
P3CV  32.6,8 90 top
P4BIAS  46.4,22 90 top
P4CV  46.4,8 90 top
P5BIAS  60.2,22 90 top
P5CV  60.2,8 90 top
P6BIAS  74,22 90 top
P6CV  74,8 90 top
P7BIAS  87.8,22 90 top
P7CV  87.8,8 90 top
P8BIAS  101.6,22 90 top
P8CV  101.6,8 90 top
PAD1  1.81,63.81 0 top
PAD2  34.4,90.31 0 top
PAD3  108.27,71.85 0 top
PAD4  108.27,82 0 top
PAD5  1.81,33.81 0 top
PAD6  107.95,59.94 0 top
PAD7  107.95,27.94 0 top
PAD9  1.81,1.81 0 top
R1  91.12,71.85 270 top
R2  88.9,69.63 270 top
R3  91.12,67.09 270 top
R4  88.9,65.18 270 top
R5  2.54,42.93 270 bottom
R6  8.1,36.92 270 bottom
R7  5.56,39.47 270 bottom
R8  17.78,47.24 90 bottom
R9  2.38,37.47 270 bottom
R10  29.53,51.53 90 bottom
R11  19.53,40.73 270 bottom
R12  22.07,40.73 90 bottom
R13  44.61,43.24 270 bottom
R14  16.99,40.73 270 bottom
R15  55.24,36.92 270 bottom
R16  29.69,36.92 270 bottom
R17  29.69,42.01 270 bottom
R18  52.55,39.47 270 bottom
R19  27.15,36.92 270 bottom
R20  50.01,36.92 270 bottom
R21  8.41,9.37 0 bottom
R22  8.41,6.51 0 bottom
R23  22.07,9.68 0 bottom
R24  39.85,36.92 270 bottom
R25  44.93,36.92 270 bottom
R26  42.39,39.47 270 bottom
R27  71.75,39.78 270 bottom
R28  69.22,42.01 270 bottom
R29  22.07,6.67 0 bottom
R30  66.67,39.47 270 bottom
R31  35.72,9.53 0 bottom
R32  35.72,6.67 0 bottom
R33  49.37,9.53 0 bottom
R34  79.85,37.72 270 bottom
R35  82.07,39.62 270 bottom
R36  49.37,6.67 0 bottom
R37  84.14,37.72 270 bottom
R38  63.18,9.53 0 bottom
R39  95.89,37.08 270 bottom
R40  93.98,38.99 270 bottom
R41  63.18,6.67 0 bottom
R42  77.15,6.67 0 bottom
R43  77.15,9.53 0 bottom
R44  91.6,37.08 270 bottom
R45  57.15,42.93 270 bottom
R46  66.42,45.72 0 bottom
R47  82.07,47.09 90 bottom
R48  96.52,43.09 270 bottom
R49  90.49,8.89 0 bottom
R50  90.49,6.19 0 bottom
R51  104.14,9.37 0 bottom
R52  104.14,6.51 0 bottom
R53  20.32,65.88 180 top
R54  20.32,67.94 180 top
R55  20.32,70.01 180 top
R56  20.32,72.07 180 top
R57  66.36,76.2 0 top
R58  66.99,61.91 270 top
R59  66.36,73.66 0 top
R60  64.45,61.91 270 top

### Tracks (layer width: path | path; a pad name or v marks a point on that pad's centre or on a via)
+12V  (via drill 0.6)
  Top 1.016: v45.72,68.36 v43.18,68.36 v43.18,71.85 | v46.35,54.39 v42.7,58.36 | D1.C 76.2,65.34 74.77,63.91 v74.77,59.15 | v43.18,90.9 v43.18,87.09
  Bottom 0.406: C17.1 76.2,84.77
  Bottom 0.61: 10.48,44.23 10.16,43.91 IC2.4 | 53.98,68.36 IC5.4 | IC1.4 33.02,68.04 33.34,68.36 | 39.37,68.36 39.05,68.04 C3.1 | C9.1 48.26,68.36 | v45.72,68.36 48.58,68.36 | 88.58,44.07 88.42,43.91 IC8.4 | 74.77,50.42 74.61,50.26 IC7.4 | 74.77,56.29 74.61,56.13 C13.1 74.77,56.13 | C7.1 35.24,50.26 | 48.9,47.88 48.74,47.72 IC6.8 | C11.1 48.9,50.26 | C5.1 10.48,50.26 | IC3.4 34.92,43.91 35.24,44.23
  Bottom 1.016: C1.+ 76.26,78.2 D1.C 76.2,84.77 76.2,87.09 72.39,90.9 v43.18,90.9 38.1,90.9 35.56,88.36 33.02,88.36 30.48,90.9 20.32,90.9 10.06,80.64 10.06,61.9 J26.4 10.48,59.46 10.48,50.26 10.48,44.23 | 35.24,44.23 35.24,50.26 35.24,50.9 v42.7,58.36 43.18,58.83 v43.18,68.36 39.37,68.36 33.34,68.36 | v45.72,68.36 48.26,68.36 48.58,68.36 53.98,68.36 | C15.1 88.42,50.26 88.58,50.1 | 88.58,50.1 88.58,44.07 | 74.77,50.42 74.77,56.13 74.77,56.29 74.77,57.88 | 74.77,57.88 82.23,57.88 88.58,51.53 88.58,50.1 | 48.9,47.88 48.9,50.26 48.9,51.85 v46.35,54.39 | 74.77,57.88 v74.77,59.15 | v43.18,87.09 v43.18,71.85
-5V
  Top 0.406: JP2.1 82.55,66.77 84.77,66.77 85.41,66.13 R4.1 R3.2
  Bottom 0.406: JP2.1 JP1.5
-8V
  Top 0.406: R2.2 89.53,68.68 | 89.53,68.68 90.48,68.68 R3.1 | JP2.3 82.55,69.31 87.31,69.31 87.95,68.67 89.53,68.67 89.53,68.68
  Bottom 0.406: JP2.3 JP1.3
-10V
  Top 0.406: JP2.5 82.55,71.85 84.45,71.85 85.73,70.58 R2.1 89.22,70.9 R1.2
  Bottom 0.406: JP1.1 JP2.5
-12V  (via drill 0.6)
  Top 0.406: R1.1 90.8,73.12 77.79,73.12
  Top 1.016: v76.04,56.61 v76.04,59.15 76.04,63.12 77.79,64.86 77.79,73.12 77.79,86.93 78.96,88.11 C2.- 77.22,90.9 D2.A 72.55,90.9 v71.28,89.63
  Bottom 0.406: 11.96,60.65 11.75,60.65 | C18.2 71.28,88.42 v71.28,89.63 | 11.75,60.75 11.73,60.73 J26.5
  Bottom 0.61: 11.75,44.23 12.06,43.91 IC2.11 | 50.16,44.23 50.48,43.91 IC6.4 | IC5.11 53.98,69.63 | 33.34,69.63 33.02,69.94 IC1.11 | C4.1 39.05,69.63 | 48.26,69.63 C10.1 | 89.85,44.07 90.01,43.91 IC8.11 | 76.04,50.42 76.36,50.26 IC7.11 | C14.1 v76.04,56.61 | C8.1 37.39,50.92 37.39,51.13 | C12.1 50.16,50.26 | C6.1 11.75,50.26 | IC3.11 36.83,43.91 36.51,44.23
  Bottom 1.016: 50.16,44.23 50.16,50.26 50.16,52.48 48.9,53.75 44.61,58.36 44.45,58.2 | 44.45,58.2 44.45,69.63 | 44.45,69.63 48.26,69.63 53.98,69.63 | 44.45,69.63 39.05,69.63 33.34,69.63 | 36.51,44.23 36.51,50.26 37.39,51.13 44.45,58.2 | v76.04,56.61 76.04,50.42 | C16.1 90.01,50.26 89.85,50.1 | 89.85,50.1 89.85,44.07 | v76.04,59.15 82.87,59.15 89.85,52.16 89.85,50.1 | 11.75,60.75 11.75,60.65 11.75,50.26 11.75,44.23 | 44.45,89.63 44.45,69.63 | 44.45,89.63 v71.28,89.63 | 44.45,89.63 38.89,89.63 36.2,86.93 32.38,86.93 29.84,89.47 21.27,89.47 11.59,79.79 J26.5
CV1_IN
  Top 0.406: J1.12 24.28,65.88 R53.1
  Bottom 0.406: IC1.3 34.29,64.77 33.02,63.5 27.94,63.5 25.44,66 J1.12
CV2_IN
  Top 0.406: R54.1 21.32,68 J1.11
  Bottom 0.406: IC1.5 31.71,66.49 31.71,67.32 31.16,67.88 24.48,67.88 J1.11
CV3_IN
  Top 0.406: R55.1 21.42,70 J1.10
  Bottom 0.406: IC1.10 31.71,71.5 31.71,70.66 30.05,68.99 25.32,68.99 24.48,69.83 J1.10
CV4_IN
  Top 0.406: R56.1 21.34,72 J1.9
  Bottom 0.406: IC1.12 34.22,71.78 34.22,72.78 33.34,73.66 27.94,73.66 26.19,71.91 24.49,71.91 J1.9
CV5_IN
  Top 0.406: R60.1 61.31,66 J2.12
  Bottom 0.406: IC5.3 55.36,66.49 55.36,67.32 55.92,67.88 59.26,67.88 60.93,66.21 J2.12
CV6_IN  (via drill 0.6)
  Top 0.406: R58.1 61.85,68 J2.11 | v56.2,69.06 55.72,69.53 54.29,69.53 52.7,67.94 52.7,64.14 v52.86,63.98
  Bottom 0.406: J2.11 60.14,69.06 v56.2,69.06 | IC5.5 52.7,64.14 v52.86,63.98
CV7_IN
  Top 0.406: R59.1 61.75,70 J2.10
  Bottom 0.406: 55.36,70.66 55.36,71.5 IC5.12 55.24,72.71 55.88,73.34 58.42,73.34 59.05,72.71 59.05,71.98 60.93,70.11 J2.10
CV8_IN
  Top 0.406: R57.1 J2.9
  Bottom 0.406: IC5.10 52.7,72.71 53.98,73.98 59.23,73.98 J2.9
CV_VCA1  (via drill 0.6)
  Top 0.406: v6.68,41.73 8.62,41.73 v10.29,40.06 13.63,40.06 17.53,36.17 24.2,36.17 24.37,36 J4.12
  Bottom 0.406: 5.56,41.73 5.56,43.12 7.51,45.07 8.4,45.07 IC2.5 | 5.56,41.73 5.56,40.62 R7.1 | v10.29,40.06 8.62,40.06 IC2.1 | v6.68,41.73 5.56,41.73
CV_VCA2  (via drill 0.6)
  Top 0.406: v15.58,43.96 v15.58,40.06 22.26,40.06 24.32,38 J4.11
  Bottom 0.406: R12.1 22.26,39.78 24.04,38 J4.11 24.37,38 | v15.58,40.06 13.91,40.06 IC2.14 | v15.58,43.96 14.47,45.07 14.19,45.07 14.08,45.18 IC2.10
CV_VCA3  (via drill 0.6)
  Top 0.406: v31.43,40.16 31.43,44.7 31.47,44.73 v31.43,44.77
  Bottom 0.406: 31.91,45.18 R17.1 25.78,40.16 24.56,40.16 J4.10 | IC3.1 31.5,40.1 v31.43,40.16 | 31.91,45.18 31.84,45.18 v31.43,44.77 | 31.91,45.18 IC3.5
CV_VCA4  (via drill 0.6)
  Top 0.406: v26.83,42.07 30.32,38.58 39.05,38.58 40.64,40.16 v40.64,40.32 40.64,43.66 v40.66,43.96
  Bottom 0.406: R26.1 42.29,40.62 40.66,40.62 40.64,40.64 v40.64,40.32 40.64,40.16 40.4,40.08 38.65,40.08 IC3.14 | 40.66,43.88 v40.66,43.96 40.72,44.05 39.23,45.07 38.59,45.07 IC3.10 | v26.83,42.07 26.76,42 J4.9
CV_VCA5
  Bottom 0.406: 52.18,45.07 53.02,45.07 53.03,45.09 | 52.7,43.12 53.85,43.12 53.85,44.89 53.66,45.09 53.34,45.09 53.03,45.09 | 52.7,43.12 49.95,43.12 49.12,43.96 49.12,45.07 47.78,46.41 47.78,46.51 46.99,46.51 IC6.7 | J5.12 60.93,36.17 59.53,36.17 55.36,40.34 52.58,40.34 R18.1 52.58,40.62 52.58,43 52.7,43.12 | IC6.3 52.23,45.09 53.03,45.09
CV_VCA6  (via drill 0.6)
  Top 0.406: v76.2,46.35 76.04,46.67 v75.09,48.9
  Bottom 0.406: IC7.14 77.61,46.34 76.66,46.37 v76.2,46.35 | v75.09,48.9 73.06,48.9 | J5.11 61.2,38.11 65.93,42.84 69.11,42.84 R28.1 69.39,43.12 69.39,43.24 74.59,45.9 74.59,48.13 73.76,48.96 73.13,48.96 73.06,48.9 | 73.06,48.9 72.97,48.99 IC7.3
CV_VCA7  (via drill 0.6)
  Top 0.406: J5.10 v78.58,40.01
  Bottom 0.406: R35.1 82.17,40.16 | R35.1 82.07,42.55 85.41,45.24 86.55,45.24 IC8.5 | IC8.1 86.55,40.16 84.77,40.16 84.36,40.57 R35.1 | v78.58,40.01 79.15,40.57 R35.1
CV_VCA8  (via drill 0.6)
  Top 0.406: v93.98,45.09 v93.98,41.91 61.29,41.91 J5.9
  Bottom 0.406: 91.91,40.01 IC8.14 93.75,40.1 93.91,39.94 | 93.91,39.94 R40.1 | 93.98,44.45 v93.98,45.09 91.91,45.09 IC8.10 | 93.91,39.94 93.98,40.01 v93.98,41.91
GND  (via drill 0.6)
  Top 0.406: C2.+ 80.12,85.96 80.12,83.18 C1.- | J3.1 99.04,87.91 99.04,86.24 J3.2 99.04,85.96 99.04,84.02 J3.3 99.04,83.74 99.04,82.07 J3.4 99.04,81.79 99.04,80.12 J3.5 99.04,79.84 99.04,78.17 J3.6 99.04,77.9 99.04,76.23 J3.7 99.04,75.95 99.04,74 J3.8 99.04,73.72 99.04,72.05 J3.9 | J6.1 99.04,57.87 99.04,56.2 J6.2 99.04,55.92 99.04,54.25 J6.3 99.04,53.97 99.04,52.02 J6.4 99.04,51.74 99.04,50.08 J6.5 99.04,49.8 99.04,48.13 J6.6 99.04,47.85 99.04,46.18 J6.7 99.04,45.9 99.04,44.23 J6.8 99.04,43.96 99.04,42.01 J6.9 | 1.95,63.71 PAD1.1 | 108.22,72.05 PAD3.1 | 108.22,82.07 PAD4.1
  Bottom 0.406: 45.78,50.35 C11.2 | 31.99,50.35 C7.2 | 29.77,52.58 R10.2 | 80.12,82.9 C1.- | 99.04,42.01 J6.9 | 99.04,52.02 J6.4 | 7.51,50.35 C5.2 | 2.27,41.94 R5.2 | 79.32,55.92 C14.2 | 82.19,47.82 R47.2
  other vias: 2.54,88.9 10.16,88.9 2.54,78.74 13.97,64.77 13.97,78.74 21.59,80.01 21.59,86.36 30.48,85.09 29.37,74.77 38.1,74.93 40.32,71.75 40.64,87.63 48.26,87.63 48.26,78.74 53.98,75.41 57.15,87.63 48.26,74.93 48.42,63.66 39.05,63.66 24.45,64.14 31.11,61.91 13.97,57.15 1.27,52.07 19.05,57.15 19.37,53.34 19.05,49.53 12.86,35.56 4.29,43.97 21.75,38.1 22.23,34.92 35.56,34.29 38.1,33.02 36.04,42.55 27.94,44.45 34.29,53.34 42.7,51.75 54.93,52.23 57.15,51.12 59.69,49.21 55.09,56.99 49.53,57.15 71.28,33.18 75.09,33.18 74.45,36.04 89.22,42.86 85.72,36.67 85.88,49.05 89.22,54.61 80.33,49.69 67.31,55.88 71.75,57.78 71.28,61.12 60.96,63.98 64.29,86.04 69.37,82.23 103.66,61.91 72.39,76.2 101.12,33.97 94.14,50.32 76.04,40.96 77.47,43.18 87.79,35.72 97,40.64 35.88,61.44 63.5,43.18 66.04,52.07 60.96,60.33 52.55,60.8 39.85,58.26
  pour Top: -1.27,30.48 -2.54,93.98 110.49,93.98 111.76,30.48
  pour Bottom: -2.54,96.52 -2.54,30.48 113.03,30.48 113.03,96.52
IN1
  Bottom 0.406: J1.8 24.38,74 23.02,72.48 23.02,45.54 J4.8
IN2  (via drill 0.6)
  Top 0.406: v22.23,45.97 22.68,45.97 J4.7
  Bottom 0.406: 24.15,76 J1.7 24.4,75.93 22.23,73.75 v22.23,45.97
IN3  (via drill 0.6)
  Top 0.406: v21.43,47.88 21.5,47.88 J4.6
  Bottom 0.406: J1.6 24.4,77.83 21.43,74.87 v21.43,47.88
IN4
  Top 0.406: J4.4 24.7,52 25.72,53.02 25.72,80.68 J1.4
IN5
  Bottom 0.406: 61.46,44 J5.8 61.48,43.96 62.59,45.07 62.55,45.09 62.55,72.65 J2.8
IN6  (via drill 0.6)
  Top 0.406: J5.7 63.46,46 v63.34,46.04
  Bottom 0.406: v63.34,46.04 63.34,73.86 J2.7
IN7  (via drill 0.6)
  Top 0.406: v64.14,48.1 61.3,48.1 J5.6
  Bottom 0.406: J2.6 61.38,78 64.14,75.25 v64.14,48.1
IN8
  Top 0.406: J5.4 61.03,52 59.69,53.34 59.69,80.49 J2.4
N$1
  Bottom 0.406: J9.4 3.81,1.27 3.33,1.75 3.33,7.62 7.14,11.43 7.14,17.04 P1BIAS.2
N$2  (via drill 0.6)
  Top 0.406: v23.93,60.37 5.84,42.29 5.84,38.11 v6.68,37.28
  Bottom 0.406: IC1.2 IC1.1 36.99,66.23 36.99,65.41 38.1,64.29 38.1,61.75 36.72,60.37 v23.93,60.37 | 8.35,35.89 R6.2 8.07,35.89 | 8.07,35.89 v6.68,37.28 | 8.07,35.89 7.62,35.44 J20.3
N$3
  Bottom 0.406: R9.1 3.06,38.11 5.01,38.11 5.29,38.39 R7.2 5.29,38.11 6.96,38.11 | 6.96,38.11 8.07,38.11 R6.1 | 6.96,38.11 6.96,40.62 7.51,41.17 8.35,41.17 IC2.2
N$4
  Bottom 1.016: D1.A 83.92,78.11 93.19,78.11 96.53,81.45 J25.10 J25.9
N$5
  Bottom 1.016: D2.C 84.99,90.9 86.38,89.52 J25.1 J25.2
N$6  (via drill 0.6)
  Top 0.406: v29.77,69.83 29.84,69.75 29.84,55.24 25.88,51.28 25.73,35.56 25.73,35.48 J8.3
  Bottom 0.406: IC1.9 29.77,71.59 | 29.77,71.59 IC1.8 | v29.77,69.83 29.77,71.59 | 29.62,35.98 R16.2 29.69,35.02 J8.3
N$7
  Bottom 0.406: P3BIAS.2 34.77,17.07 34.77,11.75 25.4,2.22 J7.4
N$8
  Bottom 0.406: 2.19,36.36 3.06,35.89 | 3.06,35.89 R9.2 | 3.06,35.89 5.08,33.87 J20.4
N$9  (via drill 0.6)
  Top 0.406: v18.36,38.67 15.86,38.67 14.74,39.78 14.74,50.08 24.24,59.58 v24.72,59.58 | v28.93,64.54 28.93,59.41 v28.89,59.53
  Bottom 0.406: IC1.6 IC1.7 29.25,65.26 v28.93,64.54 | 19.47,38.67 19.47,34.96 J15.3 | 19.47,38.67 19.47,39.78 R11.2 | 19.47,38.67 v18.36,38.67 | v28.89,59.53 24.77,59.53 v24.72,59.58
N$10  (via drill 0.6)
  Top 0.406: v15.02,34.77 16.69,34.77 16.7,34.77 18.73,34.77 20.23,33.27 J15.2
  Bottom 0.406: v15.02,34.77 12.24,37.56 12.24,42.01 12.8,42.56 13.63,42.56 IC2.12
N$11
  Bottom 0.406: R12.2 21.98,41.73 19.75,41.73 R11.1 19.47,41.73 17.25,41.73 R14.1 16.97,41.45 13.91,41.45 IC2.13
N$12
  Bottom 0.406: R22.1 10.27,5.6 P1CV.1 | P1CV.1 12.7,4.9 J9.1 | P1CV.1 12,5.65 13.34,6.99 13.34,17.46 12,18.8 P1BIAS.1
N$13
  Bottom 0.406: IC3.2 30,41.37 R17.2 R16.1 R19.1
N$14
  Bottom 0.406: R19.2 26.98,35.89 27.15,35.73 27.15,35.08 25.4,33.34 J8.4
N$15  (via drill 0.6)
  Top 0.406: v41.73,71.78 41.73,55.08 46.46,50.35 v46.46,37.28
  Bottom 0.406: IC1.13 IC1.14 37,71.78 37,72.33 38.39,73.72 39.78,73.72 v41.73,71.78 | v46.46,37.28 45.07,35.89 R25.2 44.93,35.02 J16.3
N$16
  Bottom 0.406: J16.4 39.85,34.06 R24.2
N$17
  Bottom 0.406: 40.06,38.11 42.01,38.11 42.29,38.39 R26.2 42.29,38.11 44.79,38.11 R25.1 | 40.06,38.11 R24.1 | 40.06,38.11 38.11,38.11 38.1,38.1 36.83,39.37 36.83,41.12 37.15,41.43 38.41,41.43 IC3.13
N$18
  Bottom 0.406: IC3.12 38.67,42.56 42.29,42.56 47.51,37.35 47.51,35.06 J16.2
N$19
  Bottom 0.406: IC2.6 2.72,46.45 LED1.A 2,43.97 R5.1
N$20
  Bottom 0.406: IC2.7 2.55,47.72 LED1.K
N$21
  Bottom 0.406: IC2.8 15.18,47.72 LED2.K
N$22
  Bottom 0.406: IC2.9 13.81,46.35 14.92,46.35 15.56,45.72 15.72,45.88 LED2.A 16.36,46.29 R8.1
N$23
  Bottom 0.406: IC3.6 30.32,46.45 LED3.A 29.52,45.73 28.26,46.99 28.26,49.31 R10.1
N$24
  Bottom 0.406: IC3.7 30.15,47.72 LED3.K
N$25
  Bottom 0.406: IC3.9 42.68,46.45 LED4.A 43.4,45.56 R13.1
N$26
  Bottom 0.406: IC3.8 42.85,47.72 LED4.K
N$27
  Bottom 0.406: IC7.5 71.75,51.53 69.69,53.59 69.69,64.07 JP1.6 JP1.4 JP1.2
N$28
  Bottom 0.406: J17.4 63.5,3.81 67.63,3.81 74.45,10.64 74.93,10.64 77.47,13.18 77.47,19.05 80.32,21.9 P6BIAS.2
N$29  (via drill 0.6)
  Top 0.406: v57.03,37.56 55.88,38.71 55.88,50.16 56.2,50.48 v56.2,64.54
  Bottom 0.406: IC5.1 57.59,66.49 56.75,66.49 IC5.2 56.48,66.21 56.48,64.82 v56.2,64.54 | 55.08,35.89 R15.2 | v57.03,37.56 55.36,35.89 R15.2 | J21.3 55.24,35.17 R15.2
N$30
  Bottom 0.406: J12.2 55.88,3.81 58.74,6.67 R41.2 R38.2
N$31
  Bottom 0.406: R20.1 50.08,38.11 52.02,38.11 52.3,38.39 R18.2 | R15.1 55.08,38.11 52.3,38.11 R18.2 | IC6.6 47.17,45.07 47.73,45.07 48.56,44.23 48.56,43.68 48.58,43.66 48.58,42.23 52.13,38.67 52.3,38.67 R18.2
N$32
  Bottom 0.406: P5BIAS.1 67.15,19.35 67.15,13.18 68.74,11.59 68.74,6.51 67.83,5.6 P5CV.1 66.89,5.5 66.04,6.35 64.77,6.35 64.13,5.71 | J12.1 58.42,4.92 58.74,5.24 63.66,5.24 64.13,5.71 | 64.13,5.71 R41.1
N$33  (via drill 0.6)
  Top 0.305: 59.77,34.37 62.15,34.37 63.25,33.27 J22.3
  Top 0.406: v51.47,55.64 51.47,41.17 56.6,36.04 58.1,36.04 59.77,34.37 | 63.41,33.27 J22.3
  Bottom 0.406: IC5.7 50.35,66.49 51.19,66.49 IC5.6 51.47,66.21 v51.47,55.64 | R27.2 71.62,38.39 68.62,38.39 J22.3
N$34
  Bottom 0.406: J17.1 76.2,1.27 78.1,3.17 R42.1 79.83,6.67 P6CV.1 81.8,5.6 82.55,6.35 82.55,12.7 81.28,13.97 81.28,19.12 P6BIAS.1
N$35
  Bottom 0.406: 70.11,40.62 69.11,40.62 | 69.11,40.62 68.16,40.62 R30.1 | 70.11,40.62 69.11,40.9 R28.2 69.11,40.62 | 70.11,40.62 71.62,40.62 R27.1 71.74,43 75.23,44.95 75.23,46.66 76.2,47.62 77.91,47.62 IC7.13
N$36
  Bottom 0.406: 66.61,38.39 R30.2 66.2,38.52 J22.4
N$37
  Bottom 0.406: R37.2 84.14,33.59 J23.3
N$38
  Top 0.406: J18.4 83.82,3.81 83.82,6.35 87.97,10.5 P7CV.3
N$39
  Bottom 0.406: IC8.2 86.68,41.43 87.63,41.43 88.11,40.96 88.11,39.53 87.41,38.67 R37.1 82.55,38.52 R35.2 80.02,38.67 R34.1
N$40
  Bottom 0.406: J18.2 85.09,2.54 85.09,3.81 87.31,6.19 R50.2 R49.2
N$41  (via drill 0.6)
  Top 0.406: v58.42,51.75 58.42,37.15 60.8,34.92 86.83,34.77 92.39,34.77 93.89,33.27 J24.3 | v51.44,73.66 51.44,58.74 v53.18,56.99
  Bottom 0.406: IC5.8 50.35,71.78 51.19,71.78 IC5.9 v51.44,73.66 | v58.42,51.75 v53.18,56.99 | R39.2 93.98,34.23 J24.3
N$42
  Top 0.406: P8CV.1 108.6,5.7 106.68,7.62 106.68,11.43 108.6,13.35 P8BIAS.1
  Bottom 0.406: J19.1 102.87,1.27 105.09,3.49 R52.1 105.25,6.35 106.68,6.35 107.53,5.5 P8CV.1
N$43
  Bottom 0.406: 93.55,38.11 94.59,38.11 R39.1 | 93.55,38.11 R40.2 | 93.55,38.11 91.04,38.11 R44.1 90.24,38.03 90.17,39.37 90.17,40.96 90.58,41.37 IC8.13
N$44
  Bottom 0.406: 92,42.56 IC8.12 93.43,42.64 93.81,43.02 94.61,43.02 95.09,42.55 95.09,41.27 96.58,39.78 97.25,39.15 97.25,34 J24.2
N$45
  Bottom 0.406: R45.1 57.15,45.24 LED5.A 57.13,45.72 56.52,45.72 55.78,46.45 IC6.2
N$46
  Bottom 0.406: IC6.1 56.65,47.72 LED5.K
N$47
  Bottom 0.406: IC7.1 72.74,46.51 71.28,46.51 69.6,48.19 LED6.K
N$48
  Bottom 0.406: IC7.2 72.74,47.78 71.75,47.78 70.01,49.53 68.9,49.53 67.37,48 R46.1 67.38,45.73 LED6.A
N$49
  Bottom 0.406: IC8.6 86.55,46.51 84.45,46.51 84,46.06 LED7.A 82.48,45.73 R47.1
N$50
  Bottom 0.406: IC8.7 85.2,47.72 LED7.K
N$51
  Bottom 0.406: IC8.9 95.85,46.45 96.57,45.73 LED8.A 96.52,45.55 R48.1
N$52
  Bottom 0.406: LED8.K 96.45,47.72 IC8.8
N$53
  Bottom 0.406: R14.2 16.97,39.78 16.97,35.61 16.99,35.59 16.99,35.08 15.24,33.34 J15.4
N$54
  Bottom 0.406: R23.1 24.6,8.1 P2CV.2
N$55
  Bottom 0.406: J17.2 74.3,9.53 R43.2 R42.2
N$56
  Bottom 0.406: P7CV.2 93.91,8.89 R49.1
N$57
  Bottom 0.406: IC7.6 IC7.7 71.6,54.07 70.8,54.86 70.8,58.99 72.81,61 78.47,61 J27.8 J27.7
N$58
  Top 0.406: J9.3 7.62,7.62 10.5,10.5 P1CV.3
N$59
  Bottom 0.406: IC2.3 8.62,42.56 9.46,42.56 11.13,40.9 11.13,33.66 10.74,33.27 J20.2
N$60
  Bottom 0.406: J10.1 23.02,1.43 R29.1 24.08,5.6 P2CV.1 25.92,5.6 27.15,6.83 27.15,18.1 25.84,19.4 P2BIAS.1
N$61
  Bottom 0.406: J10.2 21.12,2.07 R29.2 R23.2
N$62
  Top 0.406: J10.3 16.51,2.54 16.51,6.35 20.66,10.5 P2CV.3
N$63
  Bottom 0.406: J10.4 15.24,6.03 21.59,12.38 21.59,17.78 25.71,21.9 P2BIAS.2
N$64
  Bottom 0.406: J7.1 33.34,1.27 36.67,4.6 R32.1 37.74,5.6 P3CV.1 39.6,5.63 40.96,6.99 40.96,18.04 P3BIAS.1
N$65
  Bottom 0.406: J7.2 30.48,5.08 32.07,6.67 R32.2 R31.2
N$66
  Top 0.406: J7.3 27.94,2.38 36.06,10.5 P3CV.3
N$67
  Bottom 0.406: IC3.3 33.38,42.56 34.22,42.56 34.77,42.01 34.77,37.56 J8.2
N$68
  Bottom 0.406: J11.1 50.32,3.33 R36.1 50.64,6.35 52.07,6.35 52.92,5.5 P4CV.1 53.4,5.62 54.77,6.99 54.77,18.03 P4BIAS.1
N$69
  Bottom 0.406: J11.4 41.91,2.54 41.91,5.08 49.53,12.7 49.53,19.05 52.38,21.9 P4BIAS.2
N$70
  Top 0.406: J11.3 43.18,5.08 48.6,10.5 P4CV.3
N$71
  Bottom 0.406: J11.2 44.45,2.54 44.45,5.08 46.04,6.67 R36.2 R33.2
N$72
  Top 0.406: J12.3 62.57,10.5 P5CV.3
N$73  (via drill 0.6)
  Top 0.406: v80.01,51.53 77.47,54.07 77.47,54.13 77.15,54.45 77.15,61.69 78.42,62.96 81.28,62.96 JP2.2
  Bottom 0.406: IC7.10 v80.01,51.53 | JP2.2 JP2.4 JP2.6
N$74
  Bottom 0.406: J12.4 53.34,3.81 54.45,3.81 63.5,13.02 63.5,19.05 66.35,21.9 P5BIAS.2
N$75  (via drill 0.6)
  Top 0.406: 50.28,39.38 v50.35,39.23 55.88,33.7 J21.2 55.84,33.27 55.68,33.11 55.68,33.03
  Bottom 0.406: 47.17,43.68 IC6.5 46.83,43.81 46.83,42.7 50.31,39.23 v50.35,39.23
N$76
  Bottom 0.406: 50.08,35.89 R20.2 50.01,34.06 J21.4
N$77
  Top 0.406: J17.3 66.04,3.81 67.63,3.81 74.32,10.5 P6CV.3
N$78
  Bottom 0.406: 77.38,48.96 77.93,48.96 | 77.93,48.96 IC7.12 | 77.93,48.96 79.15,48.96 79.53,48.58 79.53,45.4 79.38,45.24 77.31,45.24 73.66,43.18 73.66,36.83 72.39,35.56 68.33,35.56 J22.2
N$79
  Bottom 0.406: J18.1 91.44,3.81 R50.1 91.6,6.35 92.71,6.35 93.56,5.5 P7CV.1 94.8,5.9 96.52,7.62 96.52,11.43 93.98,13.97 93.98,18.58 P7BIAS.1
N$80  (via drill 0.6)
  Top 0.406: v60.96,62.23 64.77,58.42 64.77,55.88 74.93,45.72 v74.93,42.86 | v55.09,68.58 55.24,68.42 v55.24,62.07
  Bottom 0.406: IC5.13 56.75,71.78 57.59,71.78 IC5.14 57.62,71.75 56.52,71.75 56.52,70.33 55.24,69.53 55.09,69.37 v55.09,68.58 | v55.24,62.07 55.4,62.23 v60.96,62.23 | v74.93,42.86 74.93,38.89 77.37,36.77 R34.2 79.85,34.7 J23.4
N$81
  Bottom 0.406: P7BIAS.2 94.29,21.9 90.17,17.78 90.17,11.75 83.82,5.4 J18.3
N$82
  Bottom 0.406: J19.3 100.33,7.62 100.33,8.89 102.23,10.79 108.43,10.79 108.14,10.6 P8CV.3
N$83
  Bottom 0.406: IC8.3 86.71,42.56 87.55,42.56 88.82,41.29 88.82,38.02 86.36,35.56 J23.2
N$84
  Bottom 0.406: J19.4 93.98,3.81 95.25,3.81 98.11,6.67 98.11,11.91 96.04,13.97 96.04,16.03 101.91,21.9 P8BIAS.2
N$85
  Bottom 0.406: J24.4 91.6,33.75 R44.2
N$86
  Bottom 0.406: R21.1 10.63,8.1 P1CV.2
N$87  (via drill 0.6)
  Top 0.406: v80.01,54.07 82.24,54.07 J27.4 J27.3
  Bottom 0.406: IC7.9 IC7.8 v80.01,54.07
N$88
  Bottom 0.406: J9.2 7.46,3.97 R22.2 R21.2
N$89
  Bottom 0.406: R31.1 38.09,8.1 P3CV.2
N$90
  Bottom 0.406: P4CV.2 51.88,9.53 R33.1
N$91
  Bottom 0.406: R38.1 65.66,8 P5CV.2
N$92
  Bottom 0.406: R43.1 79.63,8 P6CV.2
N$94
  Bottom 0.406: P8CV.2 107.23,9.37 R51.1
N$96
  Bottom 0.406: J19.2 96.52,2.54 100.49,6.51 R52.2 R51.2
N$112  (via drill 0.6)
  other vias: 46.35,71.75
N$113  (via drill 0.6)
  other vias: 46.35,66.36
OUT1  (via drill 0.6)
  Top 0.406: v26.51,53.98 26.51,81.89 J1.3
  Bottom 0.406: J4.3 24.79,54 v26.51,53.98
OUT2  (via drill 0.6)
  Top 0.406: v27.3,55.88 27.3,83.41 J1.2
  Bottom 0.406: 24.13,55.88 24.48,55.88 | 24.48,55.88 v27.3,55.88 | J4.2 24.48,55.92 24.48,55.88
OUT3  (via drill 0.6)
  Top 0.406: v28.1,57.94 28.1,84.62 J1.1
  Bottom 0.406: J4.1 24.66,58 v28.1,57.94
OUT4  (via drill 0.6)
  Top 0.406: v20.64,49.94 20.81,49.94 J4.5
  Bottom 0.406: J1.5 24.34,80 20.64,76.14 v20.64,49.94
OUT5  (via drill 0.6)
  Top 0.406: v58.9,53.98 58.9,81.7 J2.3
  Bottom 0.406: J5.3 59.08,54 59.05,53.98 v58.9,53.98
OUT6  (via drill 0.6)
  Top 0.406: v58.1,55.88 58.1,82.9 J2.2
  Bottom 0.406: J5.2 58.22,56 v58.1,55.88
OUT7  (via drill 0.6)
  Top 0.406: J2.1 57.15,83.95 v57.15,57.94
  Bottom 0.406: J5.1 57.21,58 v57.15,57.94
OUT8  (via drill 0.6)
  Top 0.406: J5.5 65.08,50 v64.93,50.01
  Bottom 0.406: v64.93,50.01 64.93,76.27 J2.5
SUM1-4
  Bottom 0.406: J6.12 98.76,36.17 98.76,36.72 97.93,37.56 97.93,65.1 98.76,65.93 J3.12
SUM1-8
  Top 0.406: J6.11 99.04,38.11 100.71,39.78 100.71,66.21 99.04,67.88 J3.11
SUM5-8
  Top 0.406: J6.10 99.04,40.06 100.15,41.17 100.15,63.15 97.93,65.38 97.93,68.99 98.76,69.83 J3.10
VREF1-4
  Bottom 0.406: P1BIAS.3 P2BIAS.3 P3BIAS.3 P4BIAS.3 53.45,24.4 57.78,28.73 J29.8 J29.7
VREF5-8
  Bottom 0.406: P8BIAS.3 P7BIAS.3 | P7BIAS.3 91.44,24.4 | 91.44,24.4 P6BIAS.3 P5BIAS.3 | J29.4 J29.3 91.44,24.4 | 94.8,25.37 P7BIAS.3

### Text on the board
tPlace: + | + | + | + | + | + | + | +
bPlace: Doepfer A-130-8 / VCA Expander / v2 rev.A | -12V red | set jumper to / select bias voltage | klangmodulator / 04/2023 | VCA1-4 | VCA5-8 | 10V | 10V | 8V | 8V | 5V | 5V